# Altium schematic sheet ESP_PIC_V2.SchDoc
size C
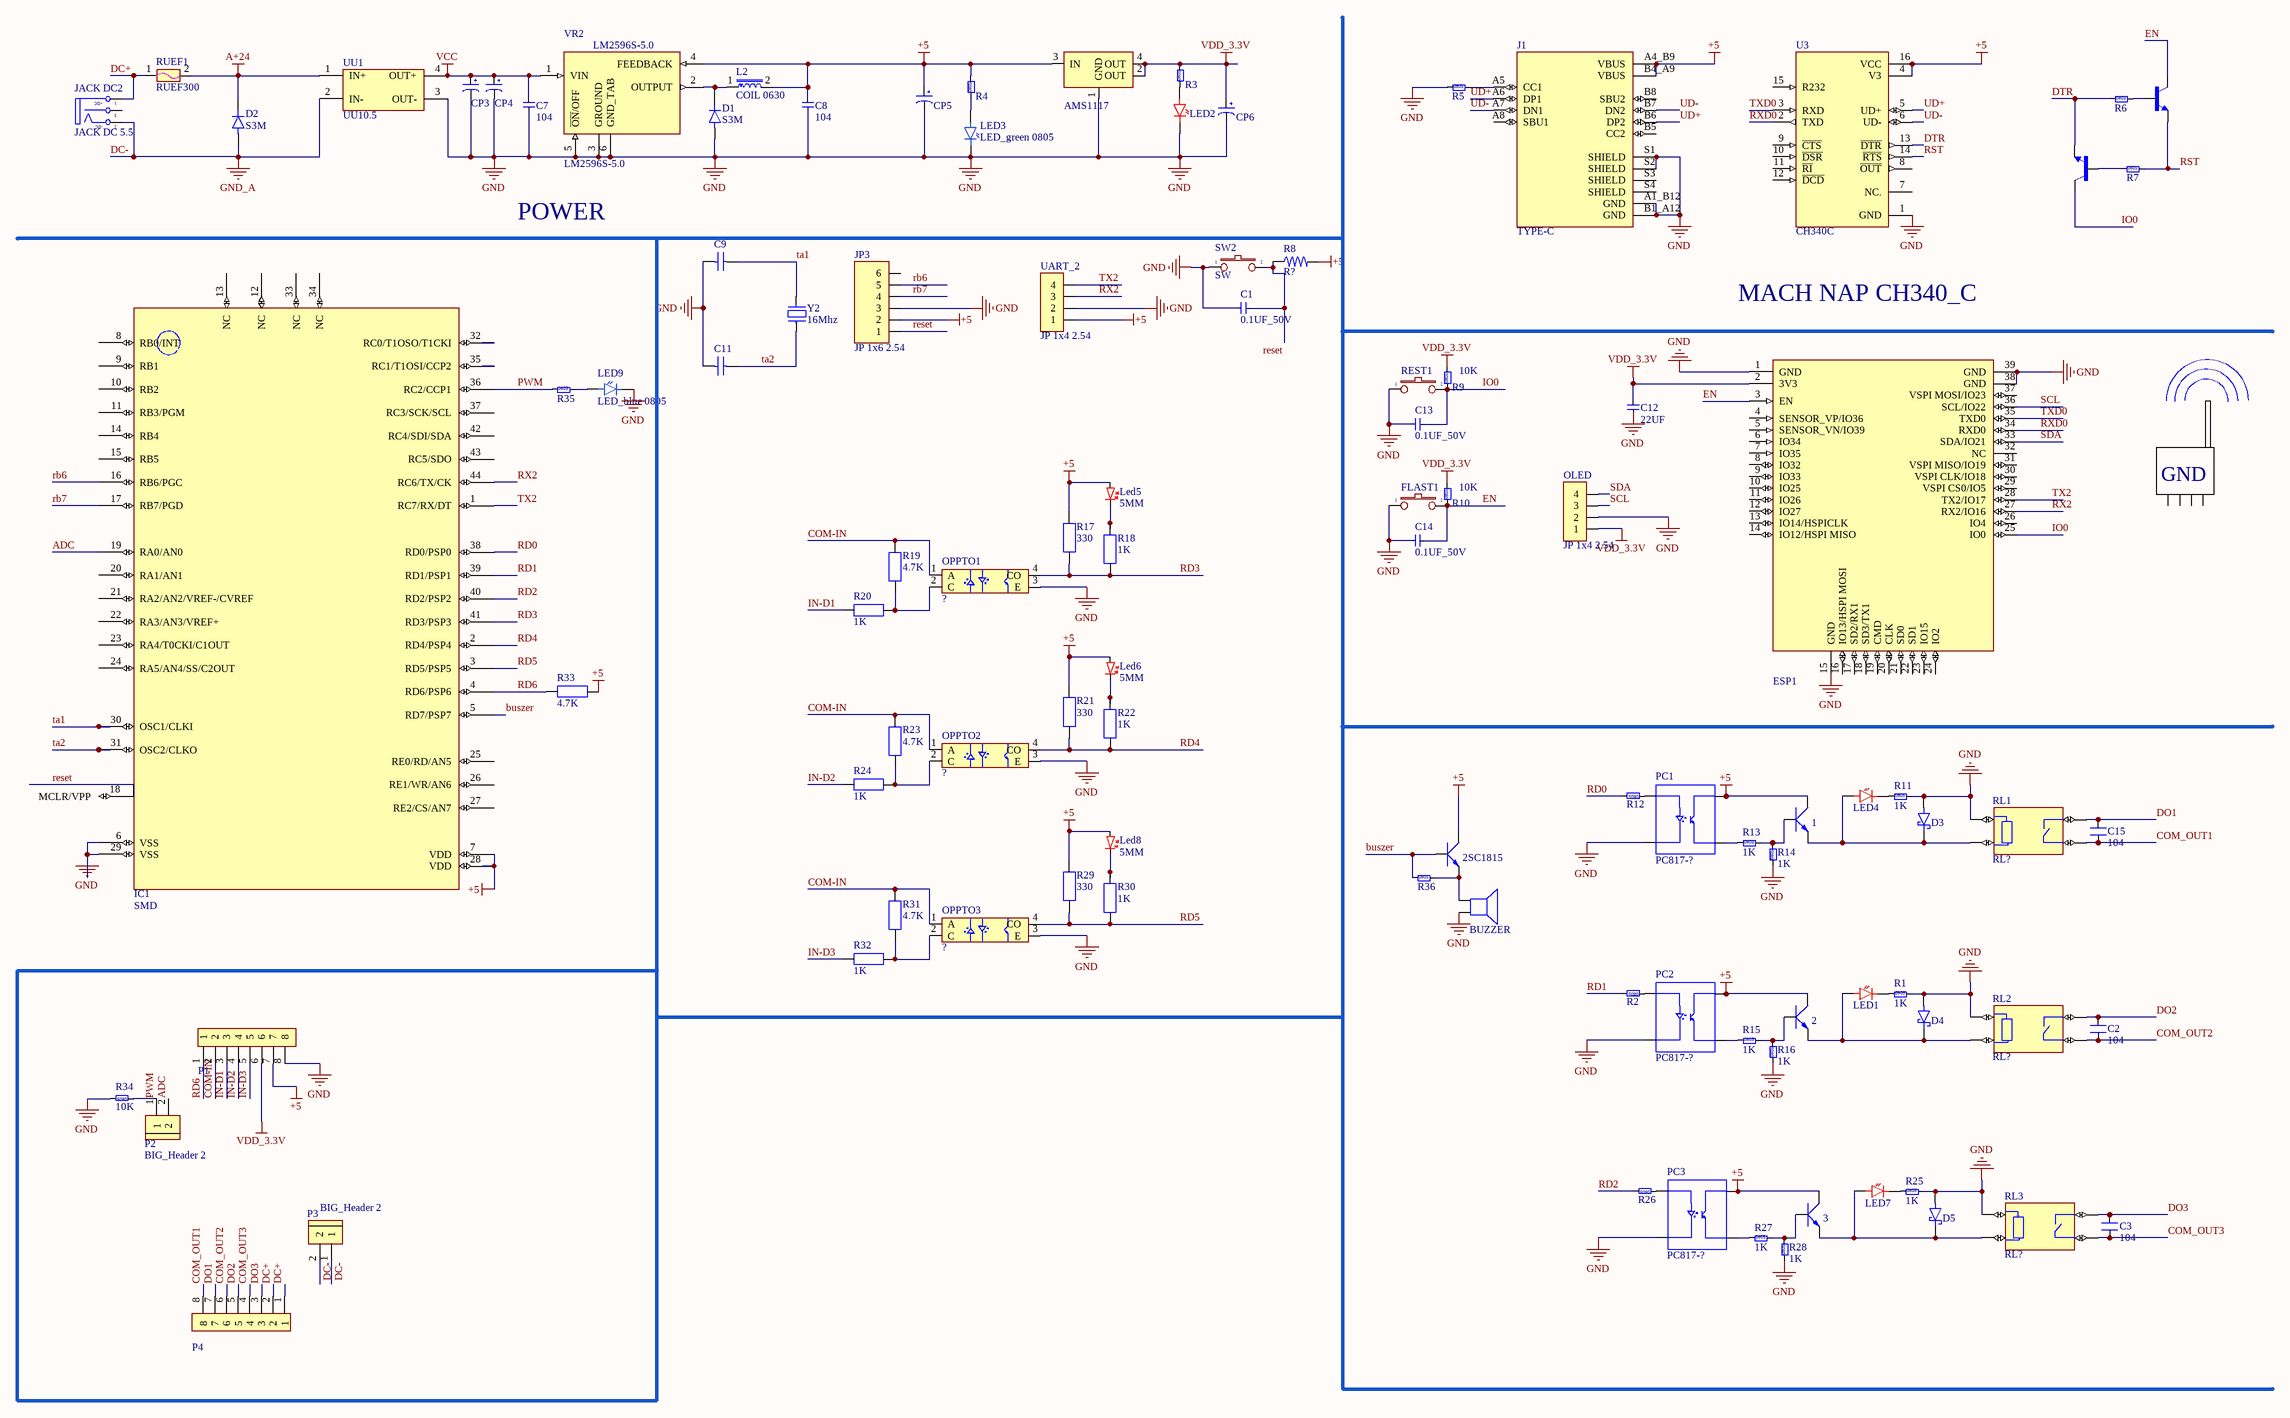
[diagram p0: ESP_PIC_V2.SchDoc]

## Parts
1  2SC1815  [SOT23-3]  (value not drawn)
2  2SC1815  [SOT23-3]  (value not drawn)
2SC1815  2SC1815  [SOT23-3]  (value not drawn)
3  2SC1815  [SOT23-3]  (value not drawn)
AMS1117  AMS1117  [SOT223-4M_AMS1117_3V3]  (value not drawn)
BUZZER  BUZZER  [Coi Chip Speacker]  (value not drawn)
C1  0.1UF_50V  [CAP0805]
C2  104  [CN2]
C3  104  [CN2]
C7  104  [CAP0805]
C8  104  [CAP0805]
C9  Capacitor Ceramic  [C0805]  (value not drawn)
C11  Capacitor Ceramic  [C0805]  (value not drawn)
C12  22UF  [CAP0805]
C13  0.1UF_50V  [CAP0805]
C14  0.1UF_50V  [CAP0805]
C15  104  [CN2]
CP3  CP?  [C10mm]  (value not drawn)
CP4  CP?  [C10mm]  (value not drawn)
CP5  220UF/16V  [CAP SMD ALUMINUM D8]  (value not drawn)
CP6  220UF/16V  [CAP SMD ALUMINUM D8]  (value not drawn)
D1  S3M  [S3M]
D2  S3M  [S3M]
D3  D?  [SS210]  (value not drawn)
D4  D?  [SS210]  (value not drawn)
D5  D?  [SS210]  (value not drawn)
ESP1  ESP32-U  [ESP32-U]  (value not drawn)
FLAST1  BUTTON?  [SW1-SMD]  (value not drawn)
IC1  SMD  [TQFP_44pin]
IPEX  IPEX  [DE ANTEN ESP]  (value not drawn)
J1  TYPE-C  [USB-TYPE-C]
JACK_DC2  JACK DC 5.5  [JACK DC 5.5]
JP3  JP 1x6 2.54  [JP 1x6 DT]
L2  COIL 0630  [COIL 0630]
LED1  LED?  [LED_SMD0805_RED - duplicate]  (value not drawn)
LED2  LED?  [LEDBLUE 0805]  (value not drawn)
LED3  LED_green 0805  [LEDgreen 0805]
LED4  LED?  [LED_SMD0805_RED - duplicate]  (value not drawn)
Led5  5MM  [LEDGREEN 0805]
Led6  5MM  [LEDGREEN 0805]
LED7  LED?  [LED_SMD0805_RED - duplicate]  (value not drawn)
Led8  5MM  [LEDGREEN 0805]
LED9  LED_blue 0805  [LEDblue 0805]
OLED  JP 1x4 2.54  [JP 1x4 DT]
OPPTO1  ?  [OPTO_4-SMD]
OPPTO2  ?  [OPTO_4-SMD]
OPPTO3  ?  [OPTO_4-SMD]
P1  BIG Heager 8  [BIG_Header 8]  (value not drawn)
P2  BIG_Header 2  [BIG_Header 2]
P3  BIG_Header 2  [BIG_Header 2]
P4  BIG Heager 8  [BIG_Header 8]  (value not drawn)
PC1  PC817-?  [OPTO_4-SMD]
PC2  PC817-?  [OPTO_4-SMD]
PC3  PC817-?  [OPTO_4-SMD]
Q1  S8050-G  [SOT23-3]  (value not drawn)
Q2  S8050-G  [SOT23-3]  (value not drawn)
R1  1K  [RES 0805]
R2  RES 0805  [RES 0805]  (value not drawn)
R3  RES 0805  [RES 0805]  (value not drawn)
R4  RES 0805  [RES 0805]  (value not drawn)
R5  RES 0805  [RES 0805]  (value not drawn)
R6  RES 0805  [RES 0805]  (value not drawn)
R7  RES 0805  [RES 0805]  (value not drawn)
R8  R?  [RES 0805]
R9  10K  [RES 0805]
R10  10K  [RES 0805]
R11  1K  [RES 0805]
R12  RES 0805  [RES 0805]  (value not drawn)
R13  1K  [RES 0805]
R14  1K  [RES 0805]
R15  1K  [RES 0805]
R16  1K  [RES 0805]
R17  330  [RES 0805]
R18  1K  [RES 0805]
R19  4.7K  [RES 0805]
R20  1K  [RES 0805]
R21  330  [RES 0805]
R22  1K  [RES 0805]
R23  4.7K  [RES 0805]
R24  1K  [RES 0805]
R25  1K  [RES 0805]
R26  RES 0805  [RES 0805]  (value not drawn)
R27  1K  [RES 0805]
R28  1K  [RES 0805]
R29  330  [RES 0805]
R30  1K  [RES 0805]
R31  4.7K  [RES 0805]
R32  1K  [RES 0805]
R33  4.7K  [RES 0805]
R34  10K  [RES 0805]
R35  RES 0805  [RES 0805]  (value not drawn)
R36  RES 0805  [RES 0805]  (value not drawn)
REST1  BUTTON?  [SW1-SMD]  (value not drawn)
RL1  RL?  [HF46F/005-HS1]
RL2  RL?  [HF46F/005-HS1]
RL3  RL?  [HF46F/005-HS1]
RUEF1  RUEF300  [RUEF300]
SW2  SW  [SW1-SMD]
U3  CH340C  [SOIC127P600X180-16N]
UART_2  JP 1x4 2.54  [JP 1x4 DT]
UU1  UU10.5  [UU10.5]
VR2  LM2596S-5.0  [TO 263 - 5]
Y2  16Mhz  [Thach Anh 2 chan cam]

## Nets
+5: 1.2(C) 2.2(C) 2SC1815.2(C) 3.2(C) AMS1117.3(IN) C8.1 CP5.1 IC1.7(VDD) IC1.28(VDD) J1.A4_B9(VBUS) J1.B4_A9(VBUS) JP3.2 L2.2 Led5.1(B) Led6.1(B) Led8.1(B) P1.7 PC1.4(CO) PC2.4(CO) PC3.4(CO) R4.2 R8.2 R17.1 R21.1 R29.1 R33.2 U3.4(V3) U3.16(VCC) UART_2.1 VR2.4(FEEDBACK)
A+24: D2.1 RUEF1.2 UU1.1(IN+)
DC-: D2.2 JACK_DC2.2(TN) P3.1 P3.2 UU1.2(IN-)  [also labelled GND_A]
GND: AMS1117.1(GND) BUZZER.2 C1.1 C7.2 C8.2 C9.1 C11.1 C12.2 C13.1 C14.1 CP3.2 CP4.2 CP5.2 CP6.2 D1.2 D3.A D4.A D5.A ESP1.1(GND) ESP1.15(GND) ESP1.38(GND) ESP1.39(GND) FLAST1.1 IC1.6(VSS) IC1.29(VSS) J1.A1_B12(GND) J1.B1_A12(GND) J1.S1(SHIELD) J1.S2(SHIELD) JP3.3 LED2.2 LED3.2 LED9.2 OLED.2 OPPTO1.3(E) OPPTO2.3(E) OPPTO3.3(E) P1.8 PC1.2(C) PC2.2(C) PC3.2(C) R1.2 R5.1 R11.2 R14.1 R16.1 R25.2 R28.1 R34.2 REST1.1 RL1.1 RL2.1 RL3.1 SW2.1 U3.1(GND) UART_2.2 UU1.3(OUT-) VR2.3(GROUND) VR2.5(~{ON}/OFF) VR2.6(GND_TAB)
VCC: C7.1 CP3.1 CP4.1 UU1.4(OUT+) VR2.1(VIN)
VDD_3.3V: AMS1117.2(OUT) AMS1117.4(OUT) C12.1 CP6.1 ESP1.2(3V3) OLED.1 P1.6 R3.2 R9.2 R10.2
ADC: IC1.19(RA0/AN0) P2.2
buszer: 2SC1815.1(B) IC1.5(RD7/PSP7) R36.1
COM-IN: OPPTO1.1(A) OPPTO2.1(A) OPPTO3.1(A) P1.2 R19.1 R23.1 R31.1
COM_OUT1: C15.1 P4.8 RL1.3
COM_OUT2: C2.1 P4.6 RL2.3
COM_OUT3: C3.1 P4.4 RL3.3
DC+: JACK_DC2.1(T) P4.1 P4.2 RUEF1.1
DO1: C15.2 P4.7 RL1.4
DO2: C2.2 P4.5 RL2.4
DO3: C3.2 P4.3 RL3.4
DTR: Q2.2(E) R6.1 U3.13(~{DTR})
EN: C14.2 ESP1.3(EN) FLAST1.2 Q1.3(C) R10.1
IN-D1: P1.3 R20.1
IN-D2: P1.4 R24.1
IN-D3: P1.5 R32.1
IO0: C13.2 ESP1.25(IO0) Q2.3(C) R9.1 REST1.2
PWM: IC1.36(RC2/CCP1) P2.1 R34.1 R35.1
rb6: IC1.16(RB6/PGC) JP3.5
rb7: IC1.17(RB7/PGD) JP3.4
RD0: IC1.38(RD0/PSP0) R12.2
RD1: IC1.39(RD1/PSP1) R2.2
RD2: IC1.40(RD2/PSP2) R26.2
RD3: IC1.41(RD3/PSP3) OPPTO1.4(CO) R17.2 R18.2
RD4: IC1.2(RD4/PSP4) OPPTO2.4(CO) R21.2 R22.2
RD5: IC1.3(RD5/PSP5) OPPTO3.4(CO) R29.2 R30.2
RD6: IC1.4(RD6/PSP6) P1.1 R33.1
reset: C1.2 IC1.18(MCLR/VPP) JP3.1 R8.1 SW2.2
RST: Q1.2(E) R7.2 U3.14(~{RTS})
RX2: ESP1.27(RX2/IO16) IC1.44(RC6/TX/CK) UART_2.3
RXD0: ESP1.34(RXD0) U3.2(TXD)
SCL: ESP1.36(SCL/IO22) OLED.3
SDA: ESP1.33(SDA/IO21) OLED.4
ta1: C9.2 IC1.30(OSC1/CLKI) Y2.2
ta2: C11.2 IC1.31(OSC2/CLKO) Y2.1
TX2: ESP1.28(TX2/IO17) IC1.1(RC7/RX/DT) UART_2.4
TXD0: ESP1.35(TXD0) U3.3(RXD)
UD+: J1.A6(DP1) J1.B6(DP2) U3.5(UD+)
UD-: J1.A7(DN1) J1.B7(DN2) U3.6(UD-)
Net1_1: 1.1(B) R13.2 R14.2
Net1_3: 1.3(E) D3.K LED4.1 RL1.2
Net2_1: 2.1(B) R15.2 R16.2
Net2_3: 2.3(E) D4.K LED1.1 RL2.2
Net2SC1815_3: 2SC1815.3(E) BUZZER.1 R36.2
Net3_1: 3.1(B) R27.2 R28.2
Net3_3: 3.3(E) D5.K LED7.1 RL3.2
NetD1_1: D1.1 L2.1 VR2.2(OUTPUT)
NetJ1_A5: J1.A5(CC1) R5.2
NetLED1_2: LED1.2 R1.1
NetLED2_1: LED2.1 R3.1
NetLED3_1: LED3.1 R4.1
NetLED4_2: LED4.2 R11.1
NetLed5_2: Led5.2(B) R18.1
NetLed6_2: Led6.2(B) R22.1
NetLED7_2: LED7.2 R25.1
NetLed8_2: Led8.2(B) R30.1
NetLED9_1: LED9.1 R35.2
NetOPPTO1_2: OPPTO1.2(C) R19.2 R20.2
NetOPPTO2_2: OPPTO2.2(C) R23.2 R24.2
NetOPPTO3_2: OPPTO3.2(C) R31.2 R32.2
NetPC1_1: PC1.1(A) R12.1
NetPC1_3: PC1.3(E) R13.1
NetPC2_1: PC2.1(A) R2.1
NetPC2_3: PC2.3(E) R15.1
NetPC3_1: PC3.1(A) R26.1
NetPC3_3: PC3.3(E) R27.1
NetQ1_1: Q1.1(B) R6.2
NetQ2_1: Q2.1(B) R7.1

Not connected (* = marked no-connect by the designer): ESP1 4(SENSOR_VP/IO36) 5(SENSOR_VN/IO39) 6(IO34) 7(IO35) 8(IO32) 9(IO33) 10(IO25) 11(IO26) 12(IO27) 13(IO14/HSPICLK) 14(IO12/HSPI_MISO) 16(IO13/HSPI_MOSI) 17(SD2/RX1) 18(SD3/TX1) 19(CMD) 20(CLK) 21(SD0) 22(SD1) 23(IO15) 24(IO2) 26(IO4) 29(VSPI_CS0/IO5) 30(VSPI_CLK/IO18) 31(VSPI_MISO/IO19) 32(NC) 37(VSPI_MOSI/IO23); IC1 8(RB0/INT) 9(RB1) 10(RB2) 11(RB3/PGM) 12(NC) 13(NC) 14(RB4) 15(RB5) 20(RA1/AN1) 21(RA2/AN2/VREF-/CVREF) 22(RA3/AN3/VREF+) 23(RA4/T0CKI/C1OUT) 24(RA5/AN4/SS/C2OUT) 25(RE0/RD/AN5) 26(RE1/WR/AN6) 27(RE2/CS/AN7) 32(RC0/T1OSO/T1CKI) 33(NC) 34(NC) 35(RC1/T1OSI/CCP2) 37(RC3/SCK/SCL) 42(RC4/SDI/SDA) 43(RC5/SDO); IPEX 2(GND) 3(GND) 4(GND) 5(GND); J1 A8(SBU1) B5(CC2) B8(SBU2) S3(SHIELD) S4(SHIELD); JACK_DC2 3(S); JP3 6; U3 7(NC.) 8(~{OUT}) 9(~{CTS}) 10(~{DSR}) 11(~{RI}) 12(~{DCD}) 15(R232)

## Notes on the sheet
- POWER
- MACH NAP CH340_C
- (in symbol JACK DC 5.5) +DC; -DC

## Library data of the parts
1 2 2SC1815 3 = 2SC1815-SMD: NPN-0.15A-50V; Value: 2SC1815-SMD
AMS1117 = AMS1117-3.3-SMD: 800mA- 3.3V - SMD; Value: AMS1117 - SMD
BUZZER = BUZZER: Còi chip; Value: Speaker
C1 C7 C8 C12-C14 = CAP 0805: CAP 0805 KHÔNG PHÂN CỰC SMD; Manufacturer: TDK Corporation; Manufacturer Part Number: C3216JB1V226M160AC; Temperature Coefficient: JB; Tolerance: ±20%; Voltage - Rated: 35V; Supplier 1: Digi-Key; RoHS: RoHS Compliant; Category: Capacitors; Stock 1: 191458; Pricing 1: 1=1.06, 10=0.835, 100=0.6262, 500=0.47312, 1000=0.41745 (USD); Packaging: Cut Tape (CT); Part Status: Active; Operating Temperature: -25°C ~ 85°C; Features: Low ESL; Ratings: -; Applications: General Purpose; Failure Rate: -; Mounting Type: Surface Mount, MLCC; Package / Case: 1206 (3216 Metric); Size / Dimension: 0.126" L x 0.063" W (3.20mm x 1.60mm); Height - Seated (Max): -; Thickness (Max): 0.069" (1.75mm); Lead Spacing: -; Lead Style: -; ComponentLink1URL: https://product.tdk.com/info/en/catalog/datasheets/mlcc_commercial_general_en.pdf; ComponentLink1Description: https://product.tdk.com/info/en/catalog/datasheets/mlcc_commercial_general_en.pdf; Supplier Part Number 1: 445-11739-1-ND; Value: CAP 0805
C2 C3 C15 = CN2: Cap np 104 => 105pF; Value: 0.1uF
C9 C11 = CapSMD: Capacitor; Value: 33p; Published: 8-Jun-2000; LatestRevisionDate: 17-Jul-2002; LatestRevisionNote: Re-released for DXP Platform.; PackageReference: RAD-0.3; Publisher: Altium Limited
CP3 CP4 = CP 1000UF/35V
CP5 CP6 = TỤ NHÔM 220UF 16V: SMD; Description 5: 47uF/200V - 22uF/350V - 400V - 10uF/450V; Description 1: 4700uF-6800uF/6,3V - 3300uF-4700uF/10V; Description 2: 2200uF-3300uF/16V - 470uF => 2200uF/25V; Description 3: 1000uF/35V-50V_470uF/63V_220uF>330uF/100V; Description 4: 47uF => 100uF/160V - 33uF-47uF/250V; Value: CP-SMD-D8; Parameter 1: *
D1 D2 = S3M: Diode Standard 1000 V 3A Surface Mount SMC (DO-214AB); MF: ON Semiconductor; MP: S3M; Check_prices: https://www.snapeda.com/parts/S3M/Onsemi/view-part/?ref=eda; Availability: In Stock; SnapEDA_Link: https://www.snapeda.com/parts/S3M/Onsemi/view-part/?ref=snap; Purchase-URL: https://pricing.snapeda.com/search/part/S3M/?ref=eda; Price: None; Package: DO-214 Fairchild Semiconductor; Value: S3M
D3-D5 = SS210: 2A, 100V, Schottky Rectifier; MF: Taiwan Semiconductor; Value: SS210; Availability: In Stock; SnapEDA_Link: https://www.snapeda.com/parts/SS210/Taiwan+Semiconductor/view-part/?ref=snap; Price: None; Package: SMD-2-2 Avago; Check_prices: https://www.snapeda.com/parts/SS210/Taiwan+Semiconductor/view-part/?ref=eda; Purchase-URL: https://pricing.snapeda.com/search/part/SS210/?ref=eda; MP: SS210
FLAST1 REST1 = BUTTON: button 2 pin; Value: BUTTON 2PIN
IC1 = 16F877A SMD: IC SMD
IPEX = ANTEN_IPEX_SMA
J1 = TYPE-C: USB Connectors 24 Receptacle 1 8.94*7.3mm RoHS; Value: TYPE-C-31; MF: HRO Electronics Co., Ltd.; MP: TYPE-C-31-M-12; Price: None; SnapEDA_Link: https://www.snapeda.com/parts/TYPE-C-31-M-12/HRO+Electronics+Co.%252C+Ltd./view-part/?ref=snap; Package: Package; Availability: Not in stock; Check_prices: https://www.snapeda.com/parts/TYPE-C-31-M-12/HRO+Electronics+Co.%252C+Ltd./view-part/?ref=eda
JACK_DC2 = JACK DC 5.5: Value: Jac DC
JP3 = JP 1x6 2.54 Duc Thang: Cắm; Ten_Linh_Kien: Jump Đơn Đực 2.54MM 1x40P Thẳng 11MM; Don_Vi: Con; Ma_Hang: MH000903; Ghi_Chu: *; Kieu_Chan: *; Chung_Loai: Cắm
L2 = COIL 0630: SMD Inductor 10uH-20%-5A; MP: CSAB0630-100M; MF: Codaca; Value: COIL 0630; SnapEDA_Link: https://www.snapeda.com/parts/CSAB0630-100M/Codaca/view-part/523415/?ref=snap; Availability: Unavailable; Price: None; Package: None
LED1 LED4 LED7 = LED SMD 0805: SMD 0805; Value: LED SMD
LED2 = LED SMD: SMD 0805; Value: LED SMD
Led5 Led6 Led8 = LED RED 5MM: Value: LED RED 5MM
OLED UART_2 = JP 1x4 2.54 Duc Thang: Cắm; Ten_Linh_Kien: Jump Đơn Đực 2.54MM 1x40P Thẳng 11MM; Don_Vi: Con; Ma_Hang: MH000903; Ghi_Chu: *; Kieu_Chan: *; Chung_Loai: Cắm
OPPTO1-OPPTO3 = OPTO 2C: SMD; Value: OPTO 2C
P1 P4 = BIG_Header 8
PC1-PC3 = PC817 SMD: SMD; Value: PC817
Q1 Q2 = S8050-G: Bipolar (BJT) Transistor NPN 25 V 1.5 A 100MHz 300 mW Surface Mount SOT-23-3; MP: SS8050G; MF: Comchip; Digi-Key_Part_Number: 641-1790-2-ND; Check_prices: https://www.snapeda.com/parts/SS8050G/Comchip/view-part/?ref=eda; Package: None; SnapEDA_Link: https://www.snapeda.com/parts/SS8050G/Comchip/view-part/?ref=snap; Value: S8050-G; Parameter 1: *; Parameter 2: *
R1-R16 R25-R28 R34-R36 = RES 0805 SMD: RES 0.36 OHM 1% 1/4W 0805; Power_Rating: .25 W; Resistance: .36; MF: TE Connectivity; MP: 2-2176053-1; Value: RES 0805 SMD; Availability: In Stock; Package: 0805; EU_RoHS_Compliance: Compliant with Exemptions; Tolerance: 1%; Price: None
R17 R19 R21 R23 R29 R31 R33 = RESISTOR  1/4W 4.7K: DIP; Value: RESISTOR  1/4W 4.7K
R18 R20 R22 R24 R30 R32 = RESISTOR  1/4W 1K: DIP; Value: RESISTOR  1/4W 1K
RL1-RL3 = HK46F: Relay: electromagnetic; SPST-NO; Ucoil: 5VDC; 5A/250VAC; 5A/30VDC; Value: HK46F; MF: Hongfa; MP: HF46F/005-HS1; Check_prices: https://www.snapeda.com/parts/HF46F/005-HS1/Hongfa/view-part/?ref=eda; Package: None; Price: None; Availability: Not in stock; SnapEDA_Link: https://www.snapeda.com/parts/HF46F/005-HS1/Hongfa/view-part/?ref=snap
SW2 = SW2: Switch button 2 pin; Value: SW chip 2 pin
U3 = CH340C: USB to serial chip CH340; MF: WCH; Price: None; Availability: Not in stock; MP: CH340C; Package: None; SnapEDA_Link: https://www.snapeda.com/parts/CH340C/WCH/view-part/?ref=snap; Check_prices: https://www.snapeda.com/parts/CH340C/WCH/view-part/?ref=eda; Value: CH340C
UU1 = UU10.5 10X13: Parameter 1: Cuộn lọc UU0.8 7*8
VR2 = LM2596S-5.0: SIMPLE SWITCHER&reg; 4.5V to 40V, 3A Low Component Count Step-Down Regulator; MP: LM2596S-5.0/NOPB; MF: Texas Instruments; Price: None; Availability: In Stock; Package: TO-263-5 Texas Instruments; SnapEDA_Link: https://www.snapeda.com/parts/LM2596S-5.0/NOPB/Texas+Instruments/view-part/?ref=snap; Check_prices: https://www.snapeda.com/parts/LM2596S-5.0/NOPB/Texas+Instruments/view-part/?ref=eda; Value: *; Purchase-URL: https://pricing.snapeda.com/search/part/LM2596S-5.0/NOPB/?ref=eda
Y2 = Thach Anh 2 chan Cam: Crystal For all Crystal 2pin.; Value: 4Mhz
ESP1 = ESP32-U: Value: ESP32-U
RUEF1 = RUEF300: Value: RUEF300